# EAGLE design TPS61032-AAA (EAGLE 9.0.1)
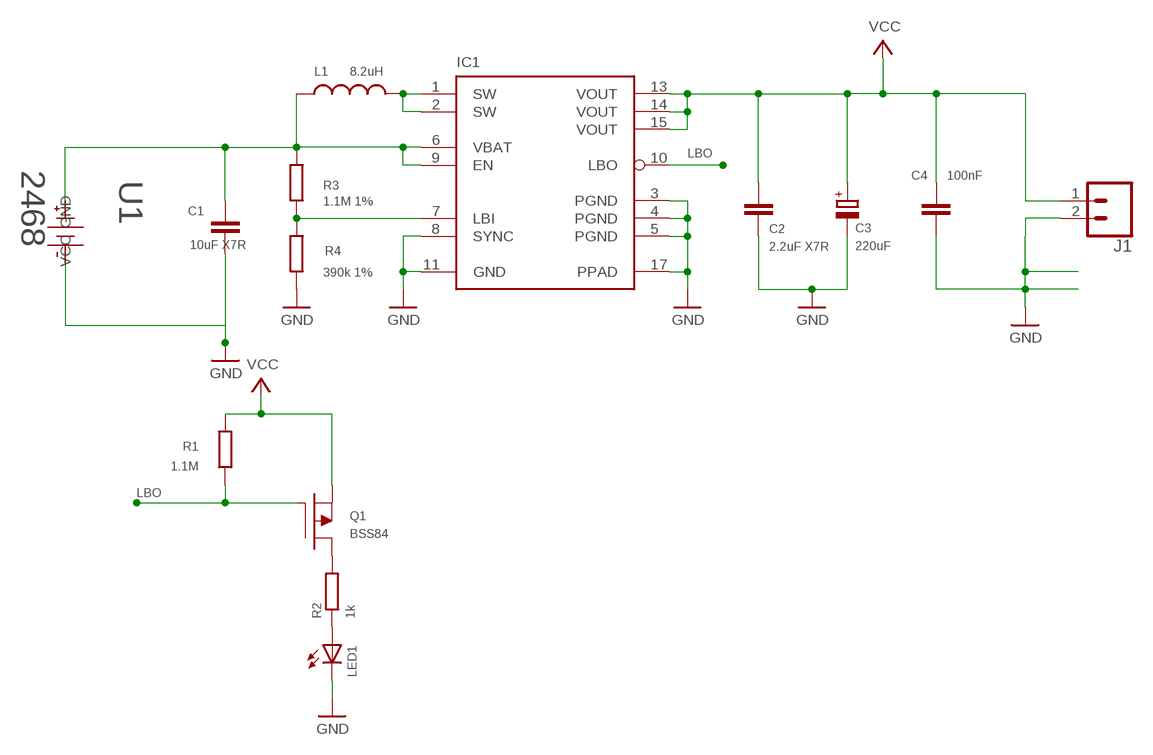
[diagram p0: schematic, sheet 1]

## Parts
C1  10uF X7R  C0805  [CAPC2012X130N]
C2  2.2uF X7R  C0805  [CAPC2012X130N]
C3  220uF  CPMLD-B  [CAPMP3528X210N]
C4  100nF  C0603  [CAPC1608X55N]
IC1  TPS61032  [MO-153+PAD]
J1  CONN_02PTH4  [1X02_XTRA_BIG]
L1  8.2uH  LWE-HCI-13MM  [7443550820]
LED1  LED0603  [LEDC1608X60N]
Q1  BSS84  PFET_SOT23  [SOT95P240X110-3N]
R1  1.1M  R0603  [RESC1508X63N]
R2  1k  R0603  [RESC1508X63N]
R3  1.1M 1%  R0603  [RESC1508X63N]
R4  390k 1%  R0603  [RESC1508X63N]
U1  2468  [BAT_HLDR_2468]

## Nets
GND: C1.2 C2.2 C3.2(-) C4.2 IC1.3(PGND) IC1.4(PGND) IC1.5(PGND) IC1.8(SYNC) IC1.11(GND) IC1.17(PPAD) J1.2 LED1.1(C) R4.1 U1.GND
LBI: IC1.7(LBI) R3.1 R4.2
LBO: IC1.10(LBO) Q1.1(GATE) R1.1
LED: LED1.2(A) R2.1
LOW: Q1.3(DRAIN) R2.2
SW: IC1.1(SW) IC1.2(SW) L1.2
VBAT: C1.1 IC1.6(VBAT) IC1.9(EN) L1.1 R3.2 U1.VCC
VCC: C2.1 C3.1(+) C4.1 IC1.13(VOUT) IC1.14(VOUT) IC1.15(VOUT) J1.1 Q1.2(SOURCE) R1.2

## Library data of the parts
C1 C2 C4 = mw-passive:C
C3 = mw-passive:CP
IC1 = mw-ti:TPS61032
J1 = SparkFun-Connectors:CONN_02: Multi connection point. Often used as Generic Header-pin footprint for 0.1 inch spaced/style header connections On any of the 0.1 inch spaced packages, you can populate with these: Break Away Headers - Straight <https://www.sparkfun.com/products/116> (PRT-00116) Break Away Male Headers - Right Angle <https://www.sparkfun.com/products/553> (PRT-00553) Female Headers <https://www.sparkfun.com/products/115> (PRT-00115) Break Away Headers - Machine Pin <https://www.sparkfun.com/products/117> (PRT-00117) Break Away Female Headers - Swiss Machine Pin <https://www.sparkfun.com/products/743> (PRT-00743) For SCREWTERMINALS and SPRING TERMINALS visit here: Screw Terimnals on SparkFun.com <https://www.sparkfun.com/search/results?term=Screw+Terminals> (5mm/3.5mm/2.54mm spacing) This device is also useful as a general connection point to wire up your design to another part of your project. Our various solder wires solder well into these plated through hole pads. Hook-Up Wire - Assortment (Stranded, 22 AWG) <https://www.sparkfun.com/products/11375> (PRT-11375) Hook-Up Wire - Assortment (Solid Core, 22 AWG) <https://www.sparkfun.com/products/11367> (PRT-11367) View the entire wire category on our website here <https://www.sparkfun.com/categories/141> Special notes: Molex polarized connector foot print use with: PRT-08233 with associated crimp pins and housings. 2.54_SCREWTERM for use with PRT-10571. 3.5mm Screw Terminal footprints for PRT-08084 5mm Screw Terminal footprints for use with PRT-08432
L1 = mw-wurth:L
LED1 = mw-diodes:LED
Q1 = mw-transistors:PFET_
R1-R4 = mw-passive:R
U1 = aaa:2468; MANUFACTURER_PART_NUMBER: 2468; VENDOR: SILICON LABS

## Board
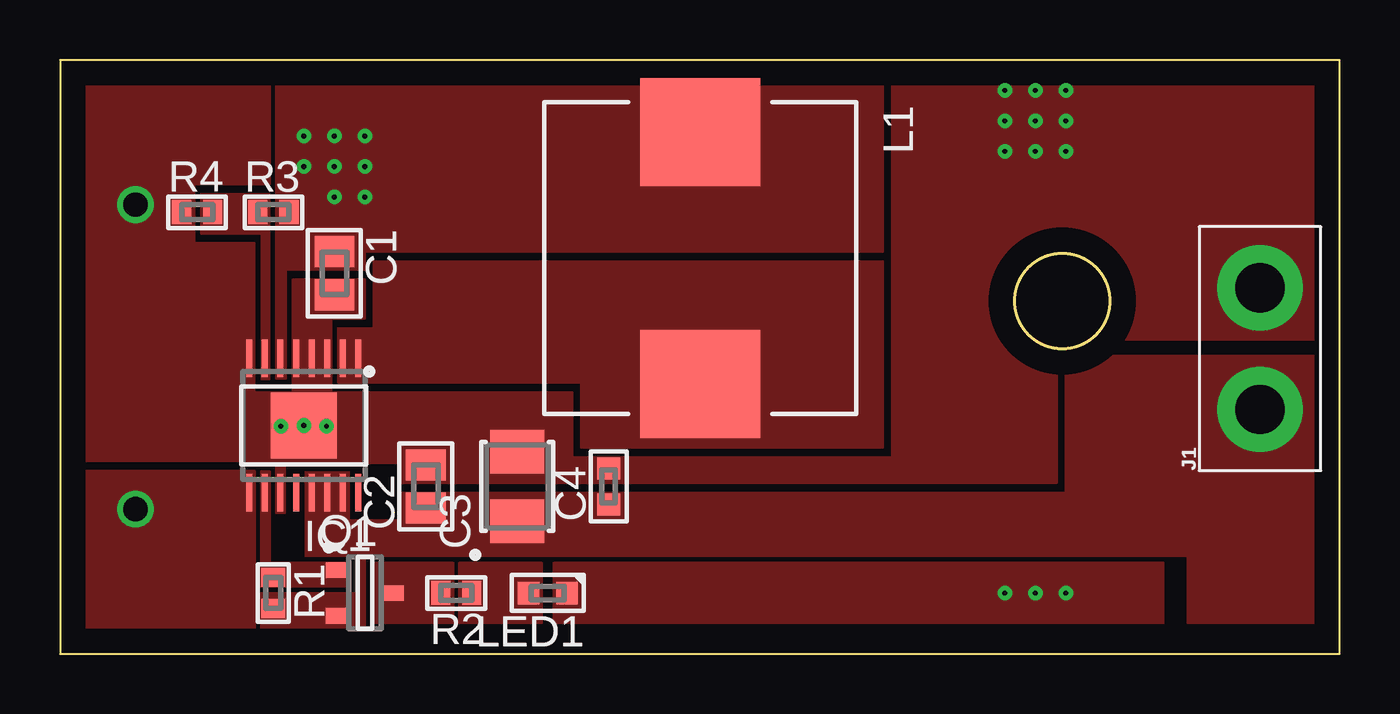
[diagram p1: board, top side]
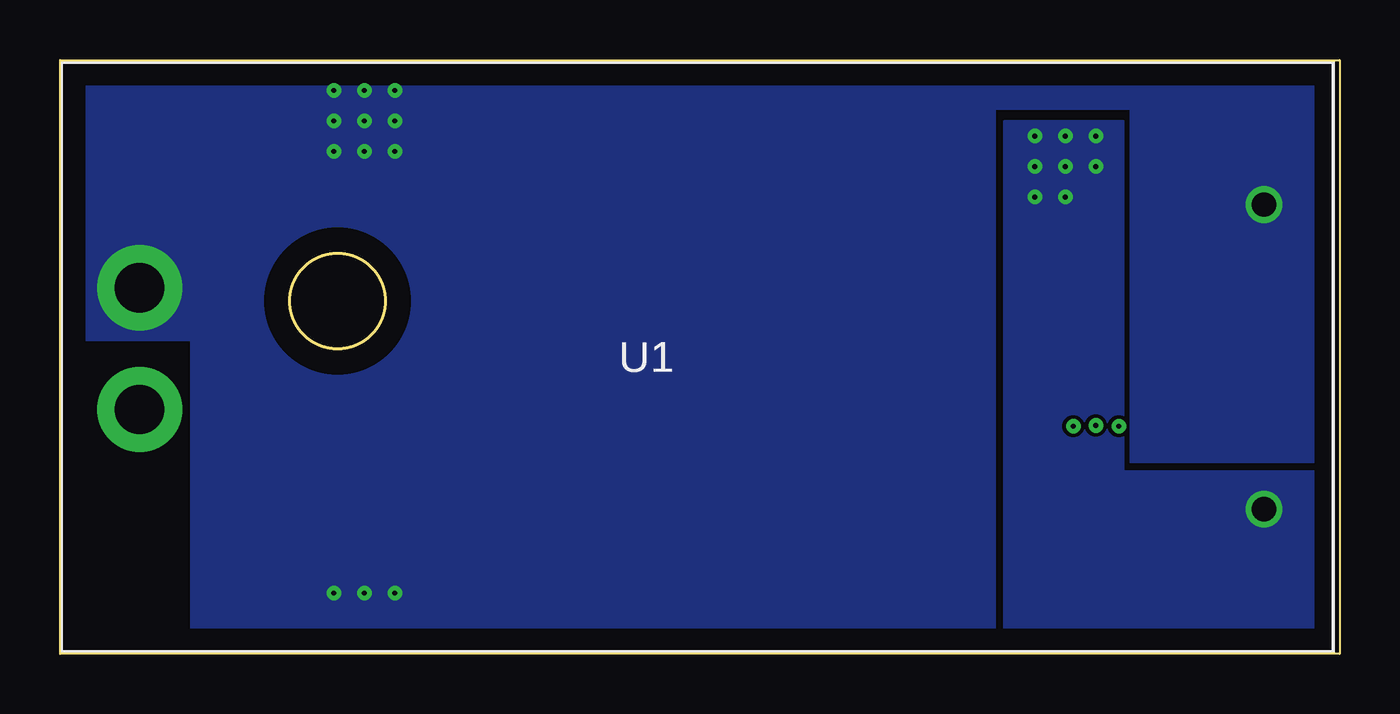
[diagram p2: board, bottom side, seen from below]

Size 53.32 x 24.77 mm. Coordinates in mm from the lower left corner, seen from the top.
Outline: 0,24.77 0,0 53.32,0 53.32,24.77 0,24.77
Copper layers (1*16): Top 0.035mm / dielectric 1.5mm / Bottom 0.035mm
Design rules "default": minimum track width 6mil, minimum drill 0.35mm, track to track 6mil, track to pad 6mil, pad to pad 6mil, via to via 6mil, smd to smd 6mil, copper to edge 40mil, drill to drill 6mil, minimum pad ring 10mil, minimum via ring 8mil, stop-mask expansion 4mil, vias tented up to drill 0mil, thermal gap 10mil

### Footprints (pad centres in the part's own frame; a part is rotated, then mirrored left to right if it is on the bottom)
CAPC2012X130N = smd 1.3 x 1.65: 1 -0.9,0; 2 0.9,0
CAPMP3528X210N = smd 1.8 x 2.25: 1 -1.45,0; 2 1.45,0
CAPC1608X55N = smd 0.9 x 0.95: 1 -0.75,0; 2 0.75,0
MO-153+PAD = smd 0.25 x 1.55: 1 -2.275,-2.8; 2 -1.625,-2.8; 3 -0.975,-2.8; 4 -0.325,-2.8; 5 0.325,-2.8; 6 0.975,-2.8; 7 1.625,-2.8; 8 2.275,-2.8; 9 2.275,2.8; 10 1.625,2.8; 11 0.975,2.8; 12 0.325,2.8; 13 -0.325,2.8; 14 -0.975,2.8; 15 -1.625,2.8; 16 -2.275,2.8 | smd 2.74 x 2.74: 17 0,0
1X02_XTRA_BIG = drill 2.057 pad 3.556: 1 -2.54,0; 2 2.54,0
7443550820 = smd 4.5 x 5: 1 -5.25,0; 2 5.25,0
LEDC1608X60N = smd 0.9 x 0.95: 1 -0.8,0; 2 0.8,0
SOT95P240X110-3N = smd 0.95 x 0.65: 1 -1.15,0.95; 2 -1.15,-0.95; 3 1.15,0
RESC1508X63N = smd 0.8 x 1: 1 -0.65,0; 2 0.65,0
BAT_HLDR_2468 = drill 1.016 pad 1.524: GND 23.622,6.35; VCC 23.622,-6.35

### Placement (x,y rotation side)
C1  11.43,15.88 270 top
C2  15.24,6.99 90 top
C3  19.05,6.99 90 top
C4  22.86,6.99 90 top
IC1  10.16,9.53 180 top
J1  50,12.73 90 top
L1  26.67,16.51 270 top
LED1  20.32,2.54 180 top
Q1  12.7,2.54 0 top
R1  8.89,2.54 270 top
R2  16.51,2.54 180 top
R3  8.89,18.41 0 top
R4  5.71,18.41 0 top
U1  26.77,12.38 0 bottom

### Tracks (layer width: path | path; a pad name or v marks a point on that pad's centre or on a via)
GND  (via drill 0.2)
  other vias: 41.91,23.5 40.64,23.5 39.37,23.5 39.37,22.23 40.64,22.23 41.91,22.23 39.37,2.54 40.64,2.54 41.91,2.54 39.37,20.95 40.64,20.95 41.91,20.95 10.16,9.53 11.1,9.49 9.2,9.49
  pour Top (no thermals): 0.64,25.4 8.74,25.4 8.74,19.56 5.59,19.56 5.59,17.14 8.1,17.14 8.1,10.92 9.7,10.92 9.7,15.62 12.7,15.62 12.7,13.97 11.3,13.97 11.3,10.92 21.34,10.92 21.34,8.21 34.67,8.21 34.67,25.27 53.32,25.27 53.32,13.08 41.53,13.08 41.53,7.11 14.22,7.11 14.22,7.95 9.37,7.95 9.37,5.87 9,5.87 9,8.03 0.64,8.03
  pour Top (no thermals): 20.57,1.27 20.57,3.81 45.97,3.81 45.97,1.27
  pour Bottom (no thermals): 8.74,8 0.64,8 0.64,25.4 53.32,25.4 53.32,13.08 47.88,13.08 47.88,0.76 14.35,0.64 14.35,22.73 8.74,22.73
LBI
  pour Top (no thermals): 8.74,11.46 8.74,19.18 5.87,19.18 5.87,17.53 8.38,17.53 8.38,11.46
LBO
  pour Top (no thermals): 12.06,3.81 12.06,2.79 8.38,2.79 8.38,7.62 8.74,7.62 8.74,3.81
LED
  pour Top (no thermals): 16.64,1.27 16.64,3.81 20.07,3.81 20.07,1.27
LOW
  pour Top (no thermals): 13.08,1.27 13.08,3.81 16.38,3.81 16.38,1.27
SW
  pour Top (no thermals): 11.58,13.59 13.08,13.59 13.08,16.38 34.29,16.38 34.29,8.59 21.72,8.59 21.72,11.3 11.58,11.3
VBAT  (via drill 0.2)
  other vias: 12.7,21.59 11.43,21.59 10.16,21.59 10.16,20.32 11.43,20.32 12.7,20.32 11.43,19.05 12.7,19.05
  pour Top (no thermals): 9.02,25.4 34.29,25.4 34.29,16.76 12.7,16.76 12.7,16 9.4,16 9.4,11.46 9.02,11.46
  pour Top (no thermals): 0.64,0.64 8.13,0.64 8.13,7.62 0.64,7.62
  pour Bottom (no thermals): 0.64,0.64 13.97,0.64 13.97,22.23 9.02,22.23 9.02,7.62 0.64,7.62
VCC
  pour Top (no thermals): 8.38,0.64 8.38,2.54 12.32,2.54 12.32,4.06 10.24,4.06 10.24,7.59 12.04,7.59 12.04,5.59 14.22,5.59 14.22,6.73 41.91,6.73 41.91,12.45 53.32,12.45 53.32,1.27 46.99,1.27 46.99,4.06 12.7,4.06 12.7,0.64

### Text on the board
_tPlace: L1
_tNames: R4 | R3 | C1 | J1 | IC1 | C4 | C2 | R1 | Q1 | C3 | R2 | LED1
_bNames: U1